# Altium schematic sheet connect.SchDoc
size A4
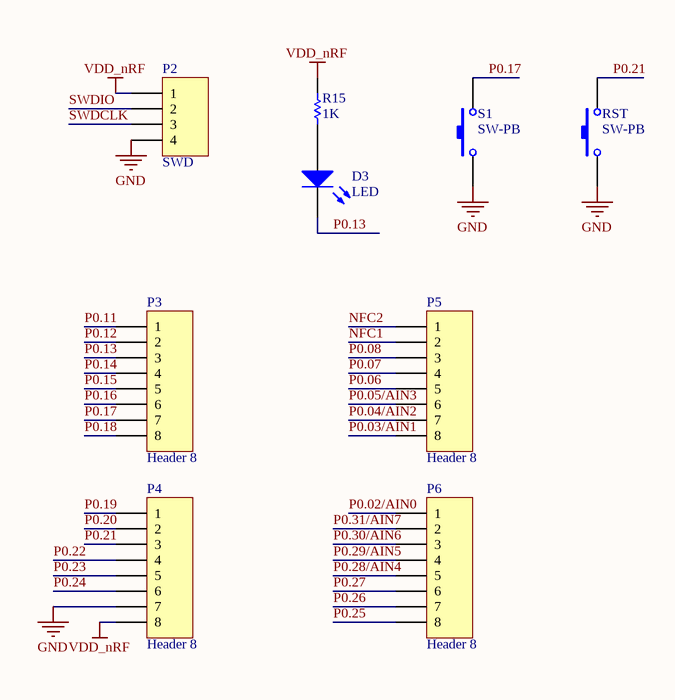
[diagram p0: connect.SchDoc]

## Parts
D3  LED  [0603]
P2  SWD  [HDR1X4]
P3  Header 8  [HDR1X8]
P4  Header 8  [HDR1X8]
P5  Header 8  [HDR1X8]
P6  Header 8  [HDR1X8]
R15  value 1K  [R0603-M]  (hidden comment: Resistors SMD)
RST  SW-PB  [SWITCH_SMD_4x3_DHT-1185]
S1  SW-PB  [SWITCH_SMD_4x3_DHT-1185]

## Nets
GND: P2.4 P4.7 RST.1 S1.1
VDD_nRF: P2.1 P4.8 R15.1
NFC1: P5.2
NFC2: P5.1
P0.02/AIN0: P6.1
P0.03/AIN1: P5.8
P0.04/AIN2: P5.7
P0.05/AIN3: P5.6
P0.06: P5.5
P0.07: P5.4
P0.08: P5.3
P0.11: P3.1
P0.12: P3.2
P0.13: D3.2(K) P3.3
P0.14: P3.4
P0.15: P3.5
P0.16: P3.6
P0.17: P3.7 S1.2
P0.18: P3.8
P0.19: P4.1
P0.20: P4.2
P0.21: P4.3 RST.2
P0.22: P4.4
P0.23: P4.5
P0.24: P4.6
P0.25: P6.8
P0.26: P6.7
P0.27: P6.6
P0.28/AIN4: P6.5
P0.29/AIN5: P6.4
P0.30/AIN6: P6.3
P0.31/AIN7: P6.2
SWDCLK: P2.3
SWDIO: P2.2
NetD3_1: D3.1(A) R15.2

## Library data of the parts
D3 = LED: Typical INFRARED GaAs LED; Published: 8-Jun-2000; LatestRevisionDate: 08-Jul-2005; LatestRevisionNote: Mech Layer 1 removed.; PackageReference: LED-0; Publisher: Altium Limited; PackageDescription: LED; 2 Leads
P2 = Header 4: Header, 4-Pin; LatestRevisionDate: 17-Jul-2002; LatestRevisionNote: Re-released for DXP Platform.; Publisher: Altium Limited
P3-P6 = Header 8: Header, 8-Pin; LatestRevisionDate: 17-Jul-2002; LatestRevisionNote: Re-released for DXP Platform.; Publisher: Altium Limited
R15 = Resistors SMD: Resistor
RST S1 = SW-PB: Switch; Published: 24-Mar-1999; LatestRevisionDate: 17-Jul-2002; LatestRevisionNote: Re-released for DXP Platform.; PackageReference: SPST-2; Publisher: Altium Limited; PackageDescription: Switch; 2 Leads